# EasyEDA Pro project ProProject_Quadrotor_Mk2.epro, board PCB4
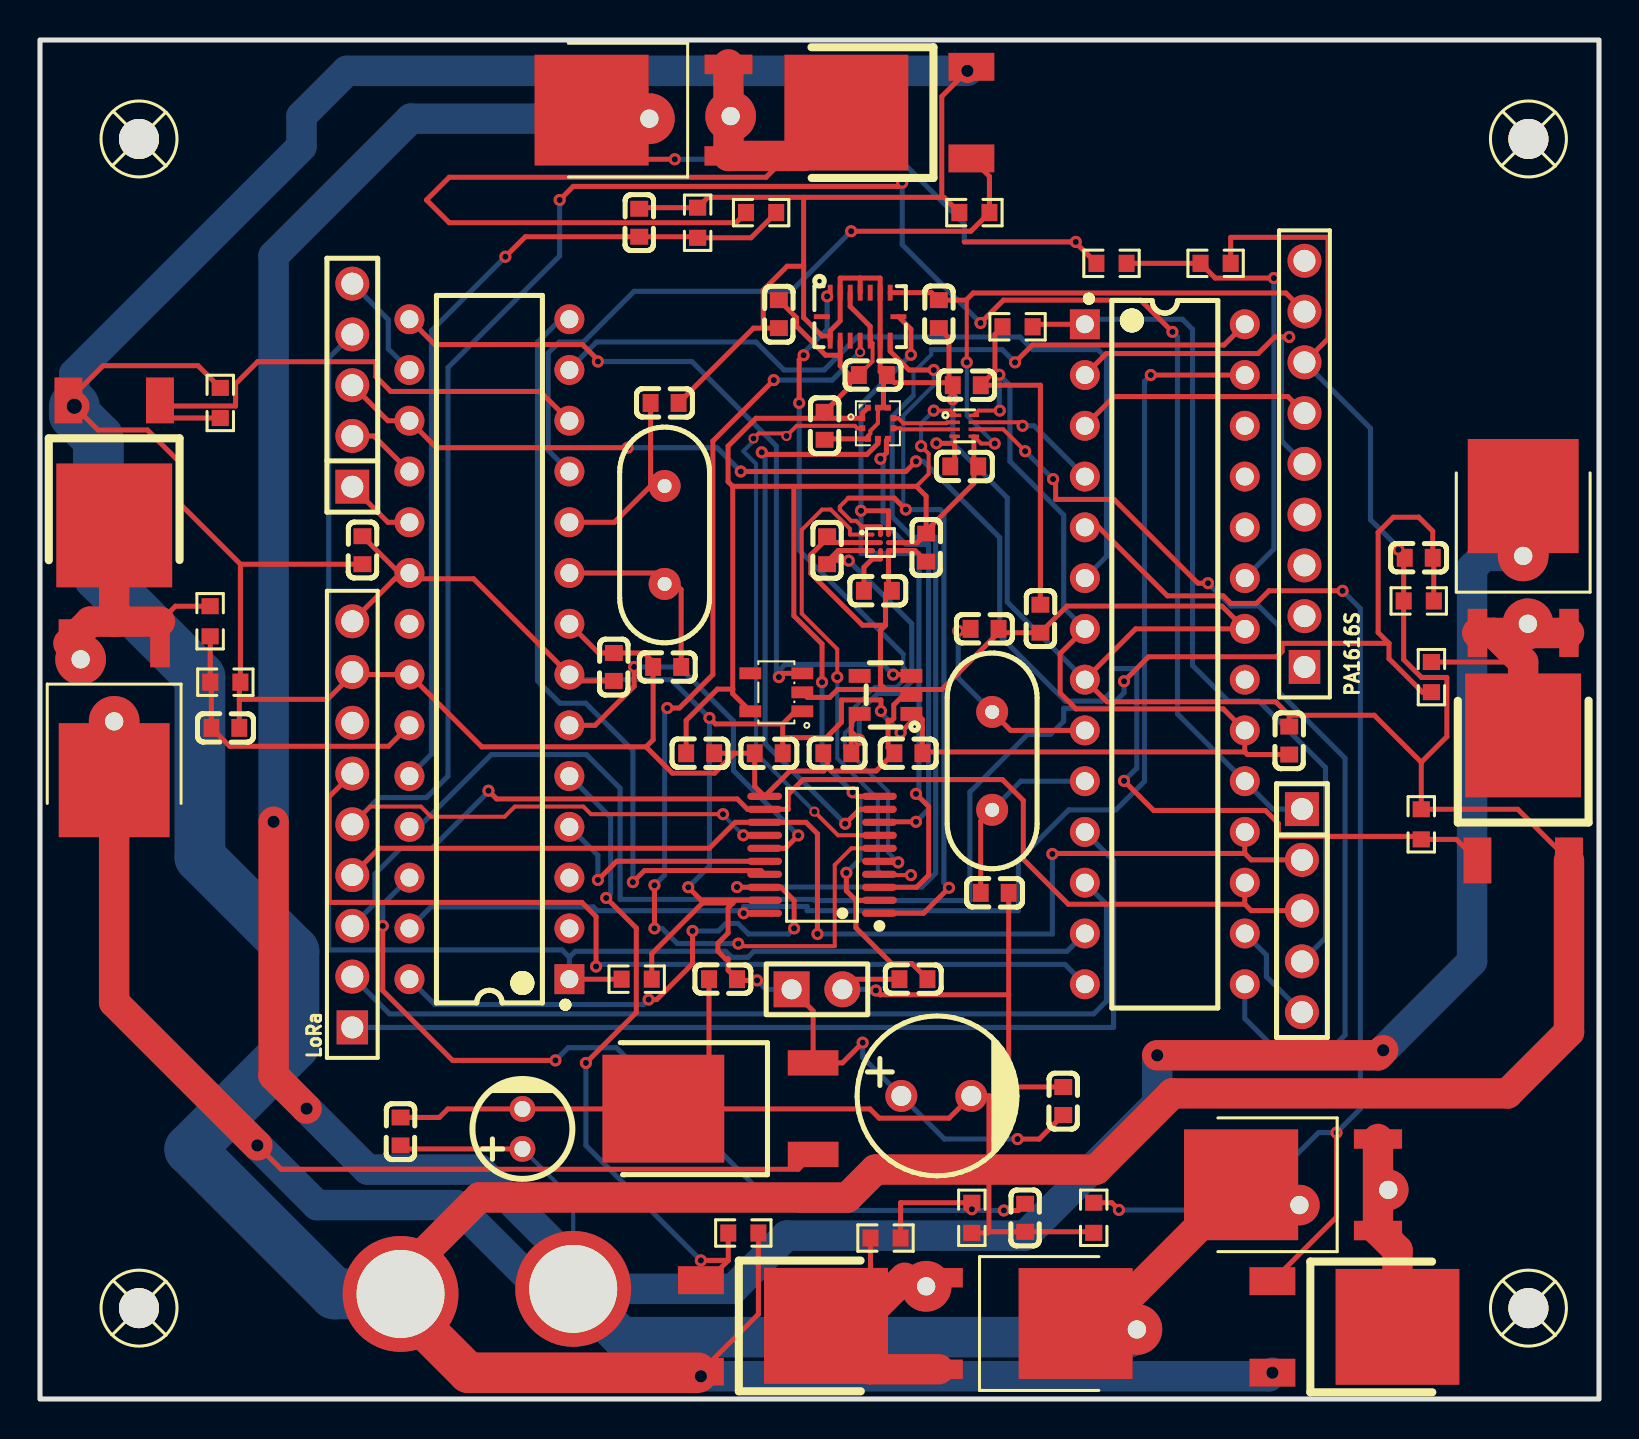
[diagram p1: board, top side]
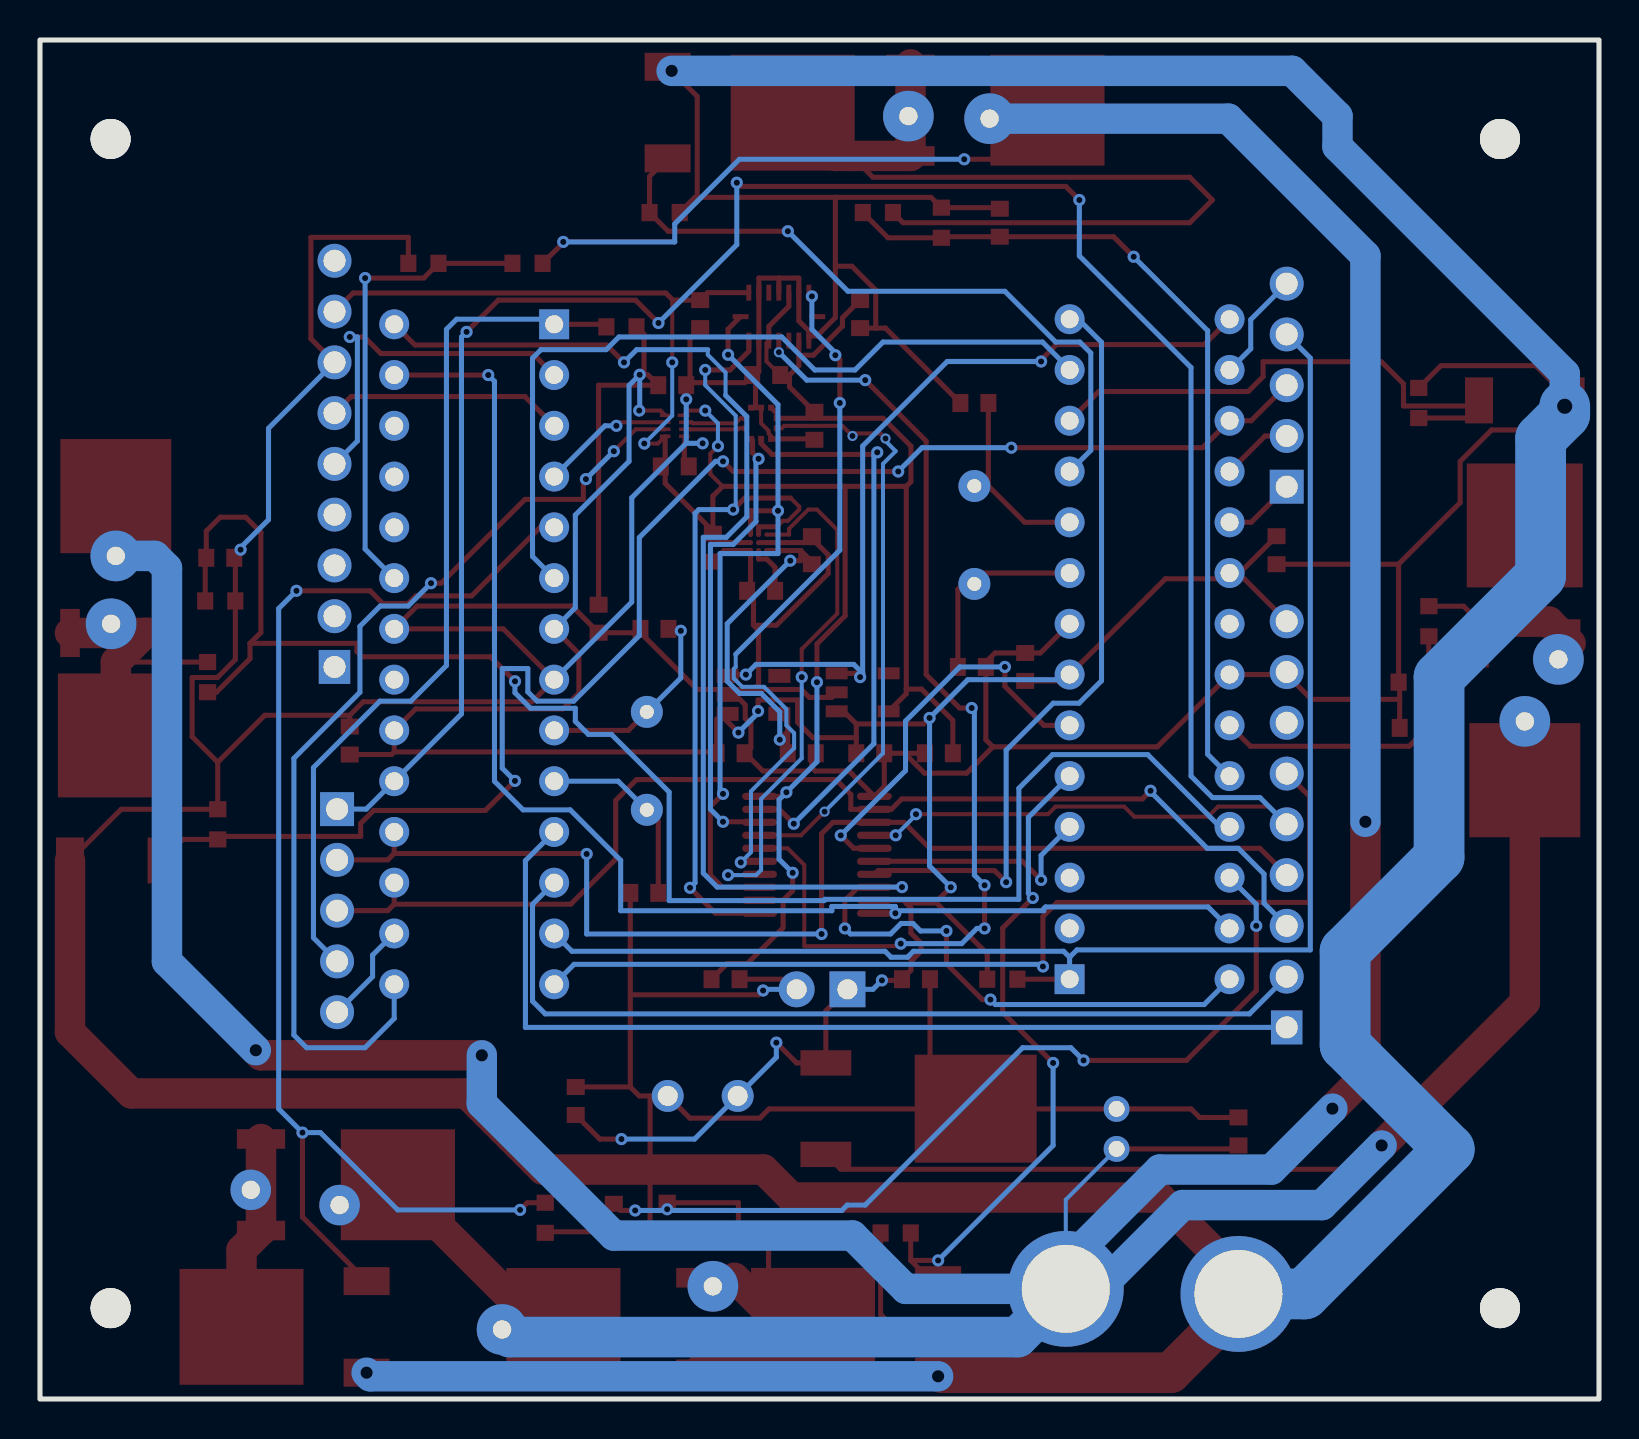
[diagram p2: board, bottom side, seen from below]

Outline 77.98 x 68 mm; copper layers: Top Layer, Bottom Layer. Coordinates in mm from the lower left corner of the outline.
Outline path: rectangle 0,68 77.98,0
Stack: Top Layer 0.035mm / Dielectric1 1.51mm FR4 er 4.5 / Bottom Layer 0.035mm

## Design rules (mm)
template: JLCPCB Capability(Two Layers Board)
spacing copperThickness1oz (default): track to track 0.102, other pairs 0.152 to 0.3
spacing copperThickness2oz: track to track 0.203, other pairs 0.152 to 0.3
track width copperThickness1oz (default): min 0.127, default 0.254, max 2.54
track width copperThickness2oz: min 0.203, default 0.254, max 2.54
differential pair differentialPair (default): width min 0.127, default 0.254, max 2.54; gap min 0.152, default 0.152
via viaSize (default): diameter min 0.5, default 0.61, max 10; hole min 0.3, default 0.305, max 6.3

## Placement (name value [footprint] x y rotation side)
1.8VR  ADP151AUJZ-1.8-R7  [TSOT-23-5_L2.9-W1.6-P0.95-LS2.8-BR]  42.29 35.23 0 top
1.8VR_C1  1uF  [C0603]  43.43 32.31 0 top
1.8VR_C2  1uF  [C0603]  39.88 32.31 0 top
3.3VR  ADP150AUJZ-3.3-R7  [SOT-23-5_L3.0-W1.7-P0.95-LS2.8-BR]  36.83 35.36 0 top
3.3VR_C1  1uF  [C0603]  36.45 32.31 180 top
3.3VR_C2  1uF  [C0603]  33.02 32.31 0 top
5V_DC  100nF  [C0603]  51.18 14.91 90 top
5VR  L7805CDT-TR  [TO-252-3_L6.5-W5.8-P4.58-BL]  34.92 14.53 90 top
12V_DC  100nF  [C0603]  18.03 13.39 90 top
BMI_DC1  100nF  [C0603]  36.96 54.28 90 top
BMI_DC2  100nF  [C0603]  44.96 54.28 270 top
BMM_CRST  2.2uF  [C0603]  41.91 40.44 0 top
BMM_DC1  100nF  [C0603]  39.37 42.47 90 top
BMM_DC2  100nF  [C0603]  44.32 42.6 270 top
BMP_DC1  100nF  [C0603]  41.66 51.23 180 top
BMP_DC2  100nF  [C0603]  39.24 48.69 270 top
C11  2.2uF  [CAP-TH_BD5.0-P2.00-D0.8-FD]  24.13 13.51 90 top
C14  100uF  [CAP-TH_BD8.0-P3.50-D0.6-FD]  44.83 15.16 0 top
C_LP1  100nF  [C0603]  9.27 33.58 180 top
C_LP2  100nF  [C0603]  29.97 58.85 270 top
C_LP3  100nF  [C0603]  68.96 42.09 0 top
C_LP4  100nF  [C0603]  49.28 9.07 90 top
D_1  MBR30100DT  [TO-252-2_L6.6-W6.1-P4.58-LS9.9-BR]  3.71 34.39 90 top
D_2  MBR30100DT  [TO-252-2_L6.6-W6.1-P4.58-LS9.9-BR]  31.01 64.48 0 top
D_3  MBR30100DT  [TO-252-2_L6.6-W6.1-P4.58-LS9.9-BR]  74.19 41.75 270 top
D_4  MBR30100DT  [TO-252-2_L6.6-W6.1-P4.58-LS9.9-BR]  48.38 3.78 180 top
D_5  MBR30100DT  [TO-252-2_L6.6-W6.1-P4.58-LS9.9-BR]  63.5 10.72 0 top
H3  -  [HDR-TH_5P-P2.54-V-M]  15.62 50.72 90 top
H4  -  [HDR-TH_5P-P2.54-V-M]  63.12 24.43 270 top
H5  -  [HDR-TH_2P-P2.54-V-M-1]  38.86 20.5 0 top
LoRa  -  [HDR-TH_9P-P2.54-V-F-1]  15.62 28.75 90 top
LS1_DC1  100nF  [C0603]  34.16 21.01 0 top
LS1_DC2  100nF  [C0603]  43.69 21.01 0 top
LS2_DC1  100nF  [C0603]  46.36 50.72 0 top
LS2_DC2  100nF  [C0603]  46.23 46.66 180 top
MCU1_DC1  100nF  [C0603]  62.48 32.94 90 top
MCU1_DC2  100nF  [C0603]  50.04 39.04 270 top
MCU1_RSTPU  10K  [R0603]  29.85 21.01 0 top
MCU2_DC1  100nF  [C0603]  28.7 36.63 90 top
MCU2_DC2  100nF  [C0603]  16.13 42.47 270 top
MCU2_RSTPU  10K  [R0603]  48.89 53.64 180 top
NOREF  -  [Pad_e160312]  2.03 37.01 0 top
NOREF#2  -  [Pad_e160313]  30.48 64.06 0 top
NOREF#3  -  [Pad_e160306]  54.86 3.48 0 top
NOREF#4  -  [Pad_e160310]  67.44 10.46 0 top
NOREF#5  -  [Pad_e160314]  34.54 64.19 0 top
NOREF#6  -  [Pad_e160315]  74.19 42.18 0 top
NOREF#7  -  [Pad_e160308]  44.32 5.64 0 top
NOREF#8  -  [Pad_e160321]  26.67 5.51 0 top
NOREF#9  -  [Pad_e160311]  3.71 33.9 0 top
NOREF#10  -  [Pad_e160316]  74.42 38.79 0 top
NOREF#11  -  [Pad_e160323]  18.03 5.26 0 top
NOREF#12  -  [Pad_e160309]  62.99 9.7 0 top
OCS1_C1  22pF  [C0603]  31.37 36.63 180 top
OCS1_C2  22pF  [C0603]  31.24 49.83 0 top
OCS2_C1  22pF  [C0603]  47.24 38.53 0 top
OCS2_C2  22pF  [C0603]  47.75 25.32 0 top
PA1616S  -  [HDR-TH_9P-P2.54-V-F-1]  63.25 46.79 90 top
R_PD1  10K  [R0603]  9.02 49.83 270 top
R_PD2  10K  [R0603]  46.74 59.36 0 top
R_PD3  10K  [R0603]  69.09 28.75 270 top
R_PD4  10K  [R0603]  35.18 8.31 180 top
R_PD5  10K  [R0603]  52.7 9.07 90 top
R_VD11  15K  [R0603]  8.51 38.91 270 top
R_VD12  10K  [R0603]  9.27 35.86 0 top
R_VD21  15K  [R0603]  36.07 59.36 0 top
R_VD22  10K  [R0603]  32.89 58.85 90 top
R_VD31  15K  [R0603]  69.6 36.12 270 top
R_VD32  10K  [R0603]  68.96 39.93 180 top
R_VD41  15K  [R0603]  42.29 8.05 0 top
R_VD42  10K  [R0603]  46.61 9.07 270 top
R_VD_BAT  20K  [R0603]  53.59 56.82 0 top
R_VD_BAT1  10K  [R0603]  58.8 56.82 0 top
SCREW1  -  [screw-hole-m2]  4.95 63.04 0 top
SCREW2  -  [screw-hole-m2]  4.95 4.55 0 top
SCREW3  -  [screw-hole-m2]  74.45 63.04 0 top
SCREW4  -  [screw-hole-m2]  74.45 4.55 0 top
T_1  IRLR2908TRPBF  [TO-252-3_L6.5-W6.1-P4.58-LS9.9-BR]  3.71 46.84 90 top
T_2  IRLR2908TRPBF  [TO-252-3_L6.5-W6.1-P4.58-LS9.9-BR]  43.46 64.36 0 top
T_3  IRLR2908TRPBF  [TO-252-3_L6.5-W6.1-P4.58-LS9.9-BR]  74.19 30.07 270 top
T_4  IRLR2908TRPBF  [TO-252-3_L6.5-W6.1-P4.58-LS9.9-BR]  36.18 3.66 180 top
T_5  IRLR2908TRPBF  [TO-252-3_L6.5-W6.1-P4.58-LS9.9-BR]  64.77 3.61 180 top
U1  MCU 1  [DIP-28_L34.6-W7.3-P2.54-LS10.2-BL]  22.48 37.52 90 top
U3  BMI088  [LGA-16_L4.5-W3.0-P0.50-BL]  41.02 54.15 270 top
U14  TXS0108EPWR  [TSSOP-20_L6.5-W4.4-P0.65-LS6.4-BL]  39.12 27.23 90 top
U15  BMM350  [WLCSP-9_L1.3-W1.3-R3-C3-P0.40-TL]  42.04 42.85 0 top
U16  MCU 2  [DIP-28_L34.6-W7.3-P2.54-LS10.2-BL]  56.26 37.26 270 top
U17  BMP390L  [LGA-10_L2.0-W2.0-P0.50-TL_BMP390L]  41.91 48.82 0 top
U18  TXS0102DQER  [X2SON-8_L1.4-W1.0-P0.35-BL]  46.23 48.69 270 top
X2  20MHz  [OSC-TH_L10.0-W4.5-P5.00]  47.63 31.93 0 top
X3  20MHz  [OSC-TH_L10.0-W4.5-P5.00]  31.24 43.23 180 top

## Footprints (pads in the part's own frame, mm; a bottom-side part is the same pattern mirrored in y, then rotated)
C0603
  rect 0.8x0.9 smd: 1(-0.7,0) 2(0.7,0)
CAP-TH_BD5.0-P2.00-D0.8-FD
  round 1.3 hole 0.8: 1(-1,0) 2(1,0)
CAP-TH_BD8.0-P3.50-D0.6-FD
  round 1.6 hole 1: 1(-1.75,0) 2(1.75,0)
DIP-28_L34.6-W7.3-P2.54-LS10.2-BL
  rect 1.5x1.5 hole 0.9: 1(-16.51,-4)
  round 1.5 hole 0.9: 2(-13.97,-4) 3(-11.43,-4) 4(-8.89,-4) 5(-6.35,-4) 6(-3.81,-4) 7(-1.27,-4) 8(1.27,-4) 9(3.81,-4) 10(6.35,-4) 11(8.89,-4) 12(11.43,-4) 13(13.97,-4) 14(16.51,-4) 15(16.51,4) 16(13.97,4) 17(11.43,4) 18(8.89,4) 19(6.35,4) 20(3.81,4) 21(1.27,4) 22(-1.27,4) 23(-3.81,4) 24(-6.35,4) 25(-8.89,4) 26(-11.43,4) 27(-13.97,4) 28(-16.51,4)
HDR-TH_2P-P2.54-V-M-1
  rect 1.8x1.8 hole 1: 1(-1.27,0)
  round 1.8 hole 1: 2(1.27,0)
HDR-TH_5P-P2.54-V-M
  rect 1.7x1.7 hole 1.1: 1(-5.08,0)
  round 1.7 hole 1.1: 2(-2.54,0) 3(0,0) 4(2.54,0) 5(5.08,0)
HDR-TH_9P-P2.54-V-F-1
  rect 1.7x1.575 hole 1.1: 1(-10.16,0)
  round 1.7 hole 1.1: 2(-7.62,0) 3(-5.08,0) 4(-2.54,0) 5(0,0) 6(2.54,0) 7(5.08,0) 8(7.62,0) 9(10.16,0)
LGA-10_L2.0-W2.0-P0.50-TL_BMP390L
  rect 0.3x0.3 smd: 1(-0.78,0.25) 2(-0.78,-0.25) 3(-0.5,-0.78) 4(0,-0.78) 5(0.5,-0.78) 6(0.78,-0.25) 7(0.78,0.25) 8(0.5,0.78) 9(0,0.78) 10(-0.5,0.78)
LGA-16_L4.5-W3.0-P0.50-BL
  rect 0.8x0.25 smd: 1(-1.2,-1.498) 2(-1.2,-0.998) 3(-1.2,-0.498) 4(-1.2,0.002) 5(-1.2,0.502) 6(-1.2,1.002) 7(-1.2,1.502) 9(1.2,1.502) 10(1.2,1.002) 11(1.2,0.502) 12(1.2,0.002) 13(1.2,-0.498) 14(1.2,-0.998) 15(1.2,-1.498)
  rect 0.25x0.8 smd: 8(0,1.915) 16(0,-1.915)
OSC-TH_L10.0-W4.5-P5.00
  round 1.6 hole 0.7: 1(0,2.45) 2(0,-2.45)
Pad_e160306
  round 2.54 hole 0.914: 29(0,0)
Pad_e160308
  round 2.54 hole 0.914: 30(0,0)
Pad_e160309
  round 2.032 hole 0.914: 31(0,0)
Pad_e160310
  round 2.032 hole 0.914: 32(0,0)
Pad_e160311
  round 2.54 hole 0.914: 33(0,0)
Pad_e160312
  round 2.54 hole 0.914: 34(0,0)
Pad_e160313
  round 2.54 hole 0.914: 35(0,0)
Pad_e160314
  round 2.54 hole 0.914: 36(0,0)
Pad_e160315
  round 2.54 hole 0.914: 37(0,0)
Pad_e160316
  round 2.54 hole 0.914: 38(0,0)
Pad_e160321
  round 5.799 hole 4.399: 39(0,0)
Pad_e160323
  round 5.799 hole 4.399: 39(0,0)
R0603
  rect 0.806x0.864 smd: 1(-0.753,0) 2(0.753,0)
screw-hole-m2
  round 2 hole 2.997: 1(0,0)
SOT-23-5_L3.0-W1.7-P0.95-LS2.8-BR
  rect 1.1x0.6 smd: 1(1.3,-0.95) 2(1.3,0) 3(1.3,0.95) 4(-1.3,0.95) 5(-1.3,-0.95)
TO-252-2_L6.6-W6.1-P4.58-LS9.9-BR
  rect 2.409x0.979 smd: 1(3.424,-2.29) 3(3.424,2.29)
  rect 5.711x5.548 smd: 2(-3.424,0)
TO-252-3_L6.5-W5.8-P4.58-BL
  rect 1.27x2.54 smd: 1(-2.288,-3.747) 3(2.288,-3.745)
  rect 5.4x6.1 smd: 2(-0.002,3.747)
TO-252-3_L6.5-W6.1-P4.58-LS9.9-BR
  rect 2.3x1.4 smd: 1(3.128,-2.29) 3(3.128,2.29)
  rect 6.2x5.8 smd: 2(-3.128,-0.004)
TSOT-23-5_L2.9-W1.6-P0.95-LS2.8-BR
  rect 1.1x0.7 smd: 1(1.294,-0.951) 2(1.294,-0.001) 3(1.294,0.951) 4(-1.294,0.951) 5(-1.294,-0.949)
TSSOP-20_L6.5-W4.4-P0.65-LS6.4-BL
  oval 0.364x1.742 smd: 1(-2.925,-2.871) 2(-2.275,-2.871) 3(-1.625,-2.871) 4(-0.975,-2.871) 5(-0.325,-2.871) 6(0.325,-2.871) 7(0.975,-2.871) 8(1.625,-2.871) 9(2.275,-2.871) 10(2.925,-2.871) 11(2.925,2.871) 12(2.275,2.871) 13(1.625,2.871) 14(0.975,2.871) 15(0.325,2.871) 16(-0.325,2.871) 17(-0.975,2.871) 18(-1.625,2.871) 19(-2.275,2.871) 20(-2.925,2.871)
WLCSP-9_L1.3-W1.3-R3-C3-P0.40-TL
  round 0.2 smd: A1(-0.4,0.4) A2(0,0.4) A3(0.4,0.4) B1(-0.4,0) B2(0,0) B3(0.4,0) C1(-0.4,-0.4) C2(0,-0.4) C3(0.4,-0.4)
X2SON-8_L1.4-W1.0-P0.35-BL
  rect 0.175x0.6 smd: 1(-0.525,-0.445)
  rect 0.175x0.53 smd: 2(-0.175,-0.48) 3(0.175,-0.48) 4(0.525,-0.48) 5(0.525,0.48) 6(0.175,0.48) 7(-0.175,0.48) 8(-0.525,0.48)

## Nets
As in the schematic, except:
12V: 5VR.1 12V_DC.1 C11.1 D_1.2 D_2.2 D_3.2 D_4.2 D_5.2 NOREF#2.35 NOREF#3.29 NOREF#6.37 NOREF#8.39 NOREF#9.33 NOREF#12.31 R_VD_BAT.1
GND: 1.8VR.2 1.8VR_C1.1 1.8VR_C2.1 3.3VR.2 3.3VR_C1.2 3.3VR_C2.2 5V_DC.2 5VR.2 12V_DC.2 BMI_DC1.1 BMI_DC2.2 BMM_CRST.2 BMM_DC1.2 BMM_DC2.2 BMP_DC1.1 BMP_DC2.2 C11.2 C14.2 C_LP1.1 C_LP2.1 C_LP3.1 C_LP4.1 H5.2 LoRa.8 LS1_DC1.1 LS1_DC2.1 LS2_DC1.1 LS2_DC2.2 MCU1_DC1.2 MCU1_DC2.2 MCU2_DC1.2 MCU2_DC2.2 NOREF#11.39 OCS1_C1.2 OCS1_C2.2 OCS2_C1.2 OCS2_C2.2 PA1616S.7 R_PD1.1 R_PD2.1 R_PD3.1 R_PD4.1 R_PD5.1 R_VD12.2 R_VD22.2 R_VD32.2 R_VD42.2 R_VD_BAT1.2 T_1.3 T_2.3 T_3.3 T_4.3 T_5.3 U1.8 U1.22 U3.2 U3.4 U3.6 U3.10 U3.15 U14.11 U15.B1 U15.B2 U15.C3 U16.8 U16.22 U17.3 U17.8 U17.9 U18.4
$1N565: D_1.1 D_1.3 NOREF.34 R_VD11.1 T_1.2
$1N1007: D_2.1 D_2.3 NOREF#5.36 R_VD21.1 T_2.2
$1N1195: D_3.1 D_3.3 NOREF#10.38 R_VD31.1 T_3.2
$1N1383: D_4.1 D_4.3 NOREF#7.30 R_VD41.1 T_4.2
$1N22123: D_5.1 D_5.3 NOREF#4.32 T_5.2

Pads without a net: 1.8VR 4; 3.3VR 4; LoRa 7; PA1616S 1 2 3 4 9; SCREW1 1; SCREW2 1; SCREW3 1; SCREW4 1; U1 2 3 21; U3 5 13 16; U16 21 24 25 26

## Via types
v1: diameter 1.219, hole 0.61, Top Layer to Bottom Layer, 8 vias
v2: diameter 1.524, hole 0.762, Top Layer to Bottom Layer, 1 via
v3: diameter 0.61, hole 0.305, Top Layer to Bottom Layer, 93 vias
v4: diameter 0.508, hole 0.3, Top Layer to Bottom Layer, 4 vias

## Routing (per net, layer and track width the routed paths; a pad name or vN(x,y) marks a point on that pad's centre or on a via; arc(x,y) is an arc through that point)
1.8V: length 18.3
  Top Layer w0.254: 39.92,42.45 39.37,41.9 BMM_DC1.1 ; 39.92,42.45 U15.C1 ; 39.92,42.45 39.92,41.94 v3(40.45,41.94) ; 1.8VR.5 40.58,33.86 40.58,33.29 ; 40.58,33.29 40.67,33.29 v3(40.98,32.99) ; 40.58,33.29 1.8VR_C2.2
  Bottom Layer w0.254: v3(40.98,32.99) 40.98,34.38 41.9,35.3 42.99,35.3 43.61,35.92 43.61,38.79 v3(40.45,41.94)
3.33V: length 127.6
  Top Layer w0.203: v3(46.36,51.87) 46.36,54.95 46.32,54.98 ; 43.83,45.66 44.45,46.28 44.45,47.29 v3(44.07,47.68) ; U3.11 41.64,52.83 41.64,51.92 BMP_DC1.2 ; 46.71,48.1 46.71,48.17 47.07,47.8 v3(47.75,47.8) ; U18.1 45.55,49.45 v3(44.7,49.45)
  Top Layer w0.254: PA1616S.8 62.32,55.34 46.68,55.34 46.32,54.98 BMI_DC2.1 44.58,55.35 U3.7 ; BMI_DC1.2 37.84,54.1 37.84,53.68 39.29,52.22 40.02,52.22 ; 40.02,52.22 40.02,51.7 40.49,51.23 ; 40.02,52.22 U3.14 ; 39.24,49.07 35.81,49.07 34.42,47.68 34.42,45.89 34.65,45.66 ; 39.24,49.07 U17.1 41.13,49.32 U17.10 ; 39.24,49.07 BMP_DC2.1 40.49,50.64 40.49,51.23 ; 34.65,45.66 37.71,45.66 ; 34.65,45.66 34.65,35.52 ; 34.65,35.52 34.65,35.29 3.3VR.5 ; 34.65,35.52 33.88,35.52 32.32,33.95 3.3VR_C2.1 ; LS1_DC2.2 43.61,21.79 42.6,21.79 40.81,23.58 40.81,24.95 ; 40.49,51.23 BMP_DC1.2 ; 37.71,45.66 43.83,45.66 44.32,45.17 44.32,43.43 ; 37.71,45.66 37.71,39.19 39.12,37.78 v3(39.12,35.86) ; 46.71,46.66 46.93,46.66 ; 46.71,46.66 46.71,45.81 44.32,43.43 ; 46.71,46.66 46.71,48.1 ; v3(40.33,26.33) 40.33,25.43 40.81,24.95 ; U3.11 41.52,53.66 40.52,54.66 U3.3 ; 44.32,43.43 BMM_DC2.1 43.88,42.85 U15.B3 ; 40.81,24.95 41.99,24.95 ; 41.99,30.15 40.85,30.15 v3(40.64,30.36)
  Bottom Layer w0.203: v3(46.36,51.87) 46.36,49.2 v3(47.75,47.8) ; v3(44.07,47.68) 44.07,48.82 v3(44.7,49.45)
  Bottom Layer w0.254: v3(40.33,26.33) 41.01,27.01 41.01,29.99 v3(40.64,30.36) 39.12,31.89 v3(39.12,35.86)
5V: length 161.5
  Top Layer w0.203: v3(48.01,49.45) 46.95,49.45 46.71,49.22
  Top Layer w0.254: 18.48,41.04 21.69,41.04 U1.7 26.8,35.93 MCU2_DC1.1 ; 18.48,41.04 17.75,41.04 LoRa.9 ; 18.48,41.04 U1.20 17.97,41.33 MCU2_DC2.1 ; 34.66,24.82 33.14,24.82 30.6,22.28 MCU1_RSTPU.2 ; 34.66,24.82 34.66,24.95 ; 34.66,24.82 34.42,24.57 34.42,23.31 33.91,22.8 33.91,22.4 34.29,22.02 34.42,22.02 34.42,21.45 LS1_DC1.2 34.92,20.95 v3(35.87,20.95) ; 60.26,32.38 44.13,32.38 ; 60.26,32.38 60.39,32.24 MCU1_DC1.1 ; 60.26,32.38 U16.20 59.19,34.53 51.82,34.53 51.02,35.32 51.02,37.29 U16.7 ; 44.13,32.38 1.8VR_C1.2 ; 44.13,32.38 44.13,34 43.86,34.28 ; 1.8VR.1 43.86,34.28 ; 43.86,34.28 43.86,34.16 v3(43.04,33.34) ; 3.3VR.1 37.78,34.41 37.15,33.78 ; 37.15,33.09 3.3VR_C1.1 ; 37.15,33.09 37.15,33.78 ; 37.15,33.09 39.32,33.09 40.09,33.86 40.09,34.98 42.06,34.98 v3(42.06,34.42) ; 5V_DC.1 49.98,13 v3(48.89,13) ; H5.1 38.67,19.42 5VR.3 40.13,16.82 v3(41.15,17.83) ; 34.66,24.95 33.08,24.95 v3(32.42,25.61) ; 34.66,24.95 36.25,24.95 ; 37.15,33.78 33.78,33.78 v3(33.48,34.08) ; 47.77,51.25 v3(47.98,51.25) ; 47.77,51.25 47.77,53.27 MCU2_RSTPU.2 ; 47.77,51.25 47.58,51.25 LS2_DC1.2 50.04,50.72 MCU1_DC2.1
  Bottom Layer w0.254: v3(48.89,13) 45.24,13 C14.1 41.15,17.1 v3(41.15,17.83) ; v3(35.87,20.95) 36.31,20.5 H5.1 ; v3(32.42,25.61) 33.48,26.67 v3(33.48,34.08) 31.57,35.99 26.73,35.99 U1.7 ; v3(48.01,49.45) 47.98,49.48 v3(47.98,51.25) 48.51,50.71 48.51,46.91 51.2,44.23 51.2,39.59 U16.7 ; v3(42.06,34.42) 42.06,34.33 v3(43.04,33.34)
12V: length 316
  Top Layer w0.254: C11.1 18.21,12.51 12V_DC.1 ; 38.67,12.24 37.93,11.5 12.06,11.5 v1(10.87,12.69) ; 46.23,57.89 51.77,57.89 R_VD_BAT.1 ; D_2.2 30.05,62.03 v3(31.75,62.03) ; 51.8,4.25 D_4.2
  Top Layer w1.524: v1(55.88,17.2) 66.93,17.2 v1(67.18,17.45) ; 51.8,4.25 53.61,4.25 D_5.2 ; v1(10.87,12.69) 3.71,19.85 D_1.2 ; v1(11.68,28.88) 11.68,16.18 v1(13.34,14.53)
  Bottom Layer w0.203: C11.1 26.67,9.97 26.67,6.78 ; NOREF#8.39 26.67,4.88
  Bottom Layer w0.254: v3(51.81,57.89) 46.23,57.89 46.23,58.79 43,62.03 v3(31.75,62.03)
  Bottom Layer w1.524: NOREF#8.39 34.67,5.51 37.34,8.18 49.28,8.18 55.88,14.78 v1(55.88,17.2) ; NOREF#8.39 26.67,6.78 21.97,11.48 16.38,11.48 v1(13.34,14.53) ; NOREF#8.39 25.02,5.51 20.83,9.7 13.86,9.7 v1(10.87,12.69) ; NOREF#2.35 18.54,64.06 11.68,57.2 v1(11.68,28.88) ; v1(67.18,17.45) 71.63,21.89 71.63,41.58 72.23,42.18 NOREF#6.37
  Bottom Layer w2.032: NOREF#8.39 29.08,3.1 54.48,3.1 NOREF#3.29
GND: length 609
  Top Layer w0.203: U17.3 41.41,48.18 41.53,48.31 ; 41.53,48.31 41.53,48.44 41.91,48.82 U17.9 ; 45.75,47.82 U18.4
  Top Layer w0.254: 47.46,8.37 47.41,8.31 R_VD42.2 ; 47.46,8.37 C_LP4.1 52.65,8.37 R_PD5.1 ; 47.46,8.37 47.46,15.16 ; OCS2_C1.2 47.94,38.34 ; 47.94,38.34 45.1,35.5 43.58,35.5 ; 47.94,38.34 MCU1_DC2.2 51.37,39.67 59.12,39.67 U16.22 54.8,38.53 U16.8 53.37,34.88 61.81,34.88 62.48,34.21 ; 39.52,53.19 U3.15 ; 39.52,53.19 39.52,53.44 40.02,53.94 U3.2 40.02,56.08 41.02,56.08 ; 39.52,53.19 39.11,53.19 38.2,54.1 38.2,56.68 ; 12V_DC.2 19.97,14.09 20.4,14.51 C11.2 31.18,14.51 ; 45.11,60.12 45.11,65.17 T_2.3 ; 45.11,60.12 38.2,60.12 ; 45.11,60.12 45.22,60.12 R_PD2.1 ; C_LP2.1 30.03,59.61 R_VD22.2 33.41,60.12 38.2,60.12 ; U17.3 39.29,48.04 BMP_DC2.2 ; 30.31,32.63 30.67,32.99 OCS1_C1.2 30.67,36.87 30.21,37.33 MCU2_DC1.2 27.94,37.33 U1.8 ; 30.31,32.63 31.63,31.31 33.74,31.31 34.73,32.31 ; 30.31,32.63 22.09,32.63 U1.22 15.62,36.25 ; 39.37,42.85 39.17,42.85 38.55,42.23 38.55,41.3 41.14,38.72 42.29,38.72 ; 39.37,42.85 BMM_DC1.2 ; 39.37,42.85 U15.B1 U15.B2 ; 42.19,51.23 42.36,51.23 42.74,50.85 45.47,50.85 45.47,53.07 BMI_DC2.2 ; 42.19,51.23 42.02,51.4 U3.10 U3.6 42.02,56.08 41.02,56.08 ; 42.19,51.23 42.19,49.6 ; 34.73,32.31 3.3VR_C1.2 35.75,30.65 36.25,30.15 37.51,31.42 39.2,31.42 39.39,31.6 ; 34.73,32.31 33.72,32.31 ; 48.45,25.32 48.45,20.22 ; 48.45,20.22 42.02,20.22 v3(41.81,20.44) ; 48.45,20.22 48.45,15.61 ; v3(44.84,47.82) 45.75,47.82 45.75,46.88 LS2_DC2.2 ; PA1616S.7 64.43,53.05 64.43,58.12 59.55,58.12 R_VD_BAT1.2 ; 62.48,34.21 MCU1_DC1.2 ; 62.48,34.21 66.74,34.21 69.09,31.86 ; 41.02,56.08 U3.4 ; 39.39,31.6 39.57,31.42 41.82,31.42 42.7,32.31 ; 39.39,31.6 39.39,32.1 1.8VR_C2.1 ; LS1_DC1.1 33.46,16.81 5VR.2 31.18,14.51 ; LS2_DC1.1 v3(45.66,50.02) ; 38.2,60.12 38.2,56.68 ; BMM_DC2.2 43.77,42.45 U15.C3 42.44,40.44 ; 42.29,35.5 42.04,35.76 42.04,38.46 42.29,38.72 ; 42.29,35.5 39.89,35.5 39.5,35.1 38.38,35.1 3.3VR.2 ; 42.29,35.5 43.58,35.5 ; OCS1_C2.2 35.69,53.58 36.18,53.58 ; 69.09,31.86 R_PD3.1 73.91,29.51 76.48,26.94 ; 69.09,31.86 70.37,33.14 70.37,36.1 69.1,36.1 68.21,36.99 R_VD32.2 68.21,42.03 C_LP3.1 ; 15.62,36.25 14.38,35.01 9.97,35.01 ; 15.62,36.25 LoRa.8 ; 9.97,35.01 C_LP1.1 ; 9.97,35.01 9.97,35.81 R_VD12.2 10.02,41.77 ; 42.29,38.72 42.29,40.29 42.44,40.44 ; 36.18,53.58 36.18,55.48 37.37,56.68 38.2,56.68 ; 36.18,53.58 BMI_DC1.1 ; 31.18,14.51 41.51,14.51 41.97,14.05 45.47,14.05 C14.2 47.46,15.16 ; 42.19,49.6 U17.8 ; 42.19,49.6 U17.9 ; 48.45,15.61 51.18,15.61 5V_DC.2 ; 48.45,15.61 48,15.16 47.46,15.16 ; 42.7,32.31 42.42,32.59 42.42,33.96 42.61,33.96 42.7,34.05 42.7,34.73 43.2,35.23 1.8VR.2 43.58,35.5 ; 42.7,32.31 42.73,32.31 ; 10.02,41.77 6.95,44.85 6.95,46.91 5.37,48.48 2.9,48.48 T_1.3 3.16,51.7 7.9,51.7 R_PD1.1 ; 10.02,41.77 MCU2_DC2.2 ; v1(33.06,1.14) T_4.3 35.93,4.24 R_PD4.1 ; H5.2 40.64,21.01 LS1_DC2.1 ; 42.44,40.44 BMM_CRST.2
  Top Layer w1.524: 76.48,26.94 76.48,18.36 73.41,15.29 56.64,15.29 52.83,11.48 41.78,11.48 40.39,10.08 21.97,10.08 18.03,6.15 NOREF#11.39
  Top Layer w2.032: 32.88,1.32 21.42,1.32 18.37,4.37
  Bottom Layer w0.254: v3(41.81,20.44) 41.75,20.5 H5.2 ; 45.66,47.82 48.38,45.09 48.38,39.87 U16.8 ; 45.66,47.82 v3(44.84,47.82) ; 45.66,47.82 v3(45.66,50.02) ; PA1616S.7 66.55,48.56 66.55,43.99 67.95,42.6
  Bottom Layer w1.524: v1(33.06,1.14) 61.46,1.14 v1(61.64,1.32) ; v2(1.72,49.67) 1.72,51.3 13.08,62.66 13.08,64.19 15.35,66.45 v1(46.39,66.45)
  Bottom Layer w2.54: NOREF#11.39 14.73,5.26 7.49,12.5 12.7,17.7 12.7,22.4 8,27.1 8,36.12 2.92,41.2 2.92,48.06 1.72,49.26 v2(1.72,49.67)
  vias: v3(67.95,42.49)
BEMF_1: length 15.3
  Top Layer w0.254: R_VD11.2 8.52,38.15 R_VD12.1 8.57,35.81 C_LP1.2 9.49,32.66 17.43,32.66 U1.23
BEMF_2: length 42.5
  Top Layer w0.254: v3(23.28,57.15) 24.28,58.15 C_LP2.2 32.84,58.15 R_VD22.1 35.56,58.1 R_VD21.2
  Bottom Layer w0.254: U1.24 19.58,32.26 19.58,53.45 v3(23.28,57.15)
BEMF_3: length 82.5
  Top Layer w0.254: 67.47,37.81 62.13,37.81 62.13,37.4 61.86,37.13 55.45,37.13 v3(54.22,35.91) ; 67.47,37.81 67.47,37.04 69.15,35.37 R_VD31.2 ; 67.47,37.81 66.93,38.35 66.93,43.36 67.69,44.12 68.96,44.12 69.66,43.42 C_LP3.2 69.71,42.03 R_VD32.1
  Bottom Layer w0.254: v3(54.22,35.91) 54.22,35.34 53.44,34.56 51.2,34.56 51.2,33.91 50.55,33.25 49.4,33.25 46.51,30.37 46.51,24.94 38.76,24.94 38.73,24.97 38.73,25 29.02,25 29.02,30.55 27.33,32.24 22.57,32.24 18.95,28.63 U1.25
BEMF_4: length 48.9
  Top Layer w0.254: v3(17.15,23.67) 17.15,20.43 20.64,16.94 v3(25.78,16.94) ; 49.28,9.77 48.94,9.43 v3(48.21,9.43) ; R_VD41.2 43.04,9.82 R_VD42.1
  Bottom Layer w0.254: U1.26 17.15,24.75 v3(17.15,23.67) ; v3(25.78,16.94) 26.42,17.58 28.83,17.58 36.7,9.7 37.6,9.7 37.87,9.43 v3(48.21,9.43)
  vias: v3(46.61,9.49)
BMI_A_INT_3.33V: length 34.1
  Top Layer w0.254: v3(37.97,49.83) 37.97,52 v3(38.2,52.22)
  Bottom Layer w0.203: 43.18,37.26 43.18,36.63 43.28,36.53 43.28,36.05 42.85,35.63 41.76,35.63 40.65,34.52 40.65,33.71 40.26,33.32 40.26,32.56 42.42,30.4 42.42,27.36 v3(42.93,26.85)
  Bottom Layer w0.254: 38.1,52.25 39.37,53.52 v3(39.37,55.17) ; 43.18,37.26 37.97,42.47 v3(37.97,49.83)
BMI_A_INT_5V: length 12
  Top Layer w0.254: U14.16 28.84,26.9 v3(27.91,25.97)
  Bottom Layer w0.254: v3(27.91,25.97) 27.91,27.2 U1.4
BMI_G_INT_3.33V: length 51.7
  Top Layer w0.203: U14.6 40.58,27.55 39.75,26.72 39.75,22.66 35.05,22.66 v3(34.92,22.78) ; v4(41.02,52.37) 41.02,52.38 U3.12
  Top Layer w0.254: v3(36.7,50.98) 33.66,47.93 33.66,36.25 31.98,34.57 v3(31.38,34.57) ; v3(30.73,25.7) v3(30.73,23.55)
  Bottom Layer w0.254: v3(34.92,22.78) 31.88,22.78 31.11,23.55 v3(30.73,23.55) ; 31.24,34.59 31.24,26.21 v3(30.73,25.7) ; v4(41.02,52.37) 39.62,50.98 v3(36.7,50.98)
BMI_G_INT_5V: length 20.1
  Top Layer w0.254: v3(37.93,28.2) 37.28,27.55 U14.15 ; U1.6 27.76,33.71 29.72,35.66 v3(29.72,36.63)
  Bottom Layer w0.254: v3(29.72,36.63) 31.98,36.63 34.69,33.92 34.69,31.44 v3(37.93,28.2)
BMM_INT_3.33V: length 26.6
  Top Layer w0.203: U14.4 42.03,26.21 v3(43.56,26.21) ; v3(39.88,36.12) 39.88,37.52 38.1,39.29 38.1,43.48 39.12,44.5 39.55,44.5 40.51,43.54 40.51,43.25 U15.A1
  Bottom Layer w0.203: v3(39.88,36.12) 39.88,32.05 41.91,30.02 41.91,26.47 42.16,26.21 v3(43.56,26.21)
BMM_INT_5V: length 38.7
  Top Layer w0.254: v3(29.65,25.86) 30.24,26.44 36.06,26.44 U14.17
  Bottom Layer w0.254: v3(29.65,25.86) 29.65,32.46 27.3,34.81 26.01,34.81 24.88,35.94 24.88,52.87 26.04,54.03 U1.14
BMP_CS_3.33V: length 2.8
  Top Layer w0.203: 45.47,48.53 45.46,48.51 43.07,48.51 43.02,48.57 U17.6
BMP_CS_5V: length 49.3
  Top Layer w0.203: 46.71,48.52 48.18,48.52 v3(49.28,47.42)
  Top Layer w0.254: v3(58.42,40.82) 57.91,40.82 53.72,45.01 50.8,45.01 50.8,45.9 v3(50.67,46.02)
  Bottom Layer w0.254: v3(58.42,40.82) 59.56,39.67 60.96,39.67 61.98,38.66 61.98,35.36 65.28,32.05 65.28,18.21 64.64,17.58 61.72,17.58 60.26,19.04 U16.15 ; v3(50.67,46.02) v3(49.28,47.42)
BMP_INT_3.33V: length 3.2
  Top Layer w0.203: U17.7 42.94,49.07 43.19,48.82 45.33,48.82 45.38,48.87 U18.2
BMP_INT_5V: length 6.7
  Top Layer w0.203: v3(49.15,48.69) 48.97,48.87 46.71,48.87
  Bottom Layer w0.254: v3(49.15,48.69) 49.72,48.69 U16.4
LORA_CS: length 45.1
  Bottom Layer w0.254: LoRa.2 17.48,19.27 52.71,19.27 53.34,19.91 53.34,24.75 U16.12
LORA_GO: length 48
  Top Layer w0.254: LoRa.6 14.46,30.14 14.46,24.85 27.1,24.85 27.81,24.14 v3(27.81,21.64)
  Bottom Layer w0.254: U16.14 51.27,21.75 27.92,21.75 v3(27.81,21.64)
LORA_RST: length 48.5
  Bottom Layer w0.254: LoRa.1 53.7,18.59 53.7,26.93 U16.11
MCU2RX_GPSTX: length 18.2
  Top Layer w0.254: v3(62.48,53.14) 61.76,53.14 60.93,52.31 53.34,52.31 U16.2
  Bottom Layer w0.254: v3(62.48,53.14) 62.1,53.14 62.1,47.93 PA1616S.5
MCU2TX_GPSRX: length 11.9
  Top Layer w0.254: U16.3 53.73,50.16 62.42,50.16 PA1616S.6
MISO_3.33V: length 23.1
  Top Layer w0.254: v3(42.04,47.04) 42.34,47.34 42.34,47.97 U17.5 ; v3(43.82,28.88) 42.01,28.88 U14.8
  Bottom Layer w0.254: v3(42.04,47.04) 42.17,46.91 42.17,43.9 43.31,42.76 44.45,42.76 44.45,29.51 v3(43.82,28.88)
MISO_MCU1: length 3.6
  Top Layer w0.254: H3.2 16.7,48.18 U1.18
MISO_MCU2: length 59.1
  Top Layer w0.254: v3(38.89,23.27) 38.89,28.28 38.32,28.85 U14.13 34.77,28.85 33.47,27.56 16.96,27.56 LoRa.4 ; 60.26,27.3 60.58,26.97 H4.2 ; 60.26,27.3 50.66,27.3 v3(50.64,27.27) ; 60.26,27.3 U16.18
  Bottom Layer w0.254: v3(50.64,27.27) 50.64,23.27 v3(38.89,23.27)
MOSI_3.33V: length 28.6
  Top Layer w0.254: U17.4 41.91,47.81 41.36,47.26 36.21,47.26 v3(36.1,47.37) ; U14.9 41,29.5 v3(40.28,28.78)
  Bottom Layer w0.254: v3(36.1,47.37) 36.27,47.2 36.27,32.79 v3(40.28,28.78)
MOSI_MCU2: length 58.1
  Top Layer w0.254: 60.26,24.76 U16.17 ; 60.26,24.76 60.58,24.43 H4.3 ; 60.26,24.76 51.43,24.76 49.18,27 49.18,29.95 48.14,30.99 38.17,30.99 37.42,30.25 37.42,29.5 U14.12 35.39,29.5 34.88,30.02 22.84,30.02 v3(22.43,30.43)
  Bottom Layer w0.254: v3(22.43,30.43) 22.43,30.39 19.59,27.55 18.04,27.55 16.76,26.27 16.76,24.81 LoRa.3
OE_5V: length 41.1
  Top Layer w0.254: v3(27.91,51.91) 27.91,51.99 27.14,52.76 19.75,52.76 U1.15 ; 1.8VR.3 43.52,36.25 v3(42.67,36.25) ; v3(36.96,36.12) 37.14,36.31 3.3VR.3
  Bottom Layer w0.254: 36.83,36.31 36.96,36.18 v3(36.96,36.12) ; 36.83,36.31 36.83,47.68 32.6,51.91 v3(27.91,51.91) ; 36.83,36.31 37.27,36.75 42.16,36.75 v3(42.67,36.25)
PWM_FAN: length 65.4
  Top Layer w0.254: v3(65.15,40.44) 61.47,40.44 60.83,39.8 59.56,39.8 59.18,40.18 56.39,40.18 52.96,43.61 U16.5 ; v3(53.97,9.46) 53.61,9.82 R_PD5.2 ; T_5.1 64.85,9.1 v3(64.85,13.33)
  Bottom Layer w0.254: v3(65.15,40.44) 66.04,39.55 66.04,14.52 v3(64.85,13.33) 63.95,13.33 60.08,9.46 v3(53.97,9.46)
PWM_T1: length 27.3
  Top Layer w0.254: U1.12 25.01,50.41 17.55,50.41 16.8,51.15 16.8,51.9 10.89,51.9 9.78,50.79 9.78,49.68 6,49.68 ; 6,49.68 6.6,49.08 R_PD1.2 ; 6,49.68 T_1.1
PWM_T2: length 34.4
  Top Layer w0.254: v3(40.57,58.43) 46.56,58.43 R_PD2.2 47.49,61.17 T_2.1
  Bottom Layer w0.254: v3(40.57,58.43) 37.57,55.42 29.72,55.42 27.18,52.88 25.97,52.88 25.42,52.33 25.42,47.46 U1.11
PWM_T3/MOSI: length 76
  Top Layer w0.254: v3(54.22,30.93) 55.7,29.45 61.29,29.45 61.94,28.8 61.94,28.15 68.94,28.15 R_PD3.2 70.84,28 T_3.1 ; v3(35.05,46.41) 43.31,46.41 v3(43.82,46.91) ; v3(29.4,47.6) 19.83,47.6 U1.17 17.4,48.95 H3.3
  Bottom Layer w0.254: v3(54.22,30.93) 54.86,31.56 54.86,36.55 53.58,36.55 53.58,35.38 53.11,34.92 51.28,34.92 48,38.2 48,43.1 44.19,46.91 v3(43.82,46.91) ; v3(29.4,47.6) 33.86,47.6 v3(35.05,46.41)
PWM_T4: length 33.7
  Top Layer w0.254: 34.43,6.93 33.44,5.95 T_4.1 ; 34.43,6.93 v3(33.06,6.93) ; 34.43,6.93 R_PD4.2 ; v3(27.3,16.81) 29.83,19.34 29.83,23.56 v3(28.32,25.07)
  Bottom Layer w0.254: v3(33.06,6.93) 27.3,12.69 v3(27.3,16.81) ; U1.5 28.54,29.1 28.54,25.29 v3(28.32,25.07)
RST_MCU1: length 73.7
  Top Layer w0.254: U1.1 MCU1_RSTPU.1
  Bottom Layer w0.254: U16.13 51.37,22.4 35.71,22.4 35.41,22.1 34.59,22.1 34.29,22.4 26.78,22.4 26.48,22.1 ; 26.48,22.1 U1.1 ; 26.48,22.1 26.11,22.47 14.44,22.47 14.44,52.08 H3.4
RST_MCU2: length 44.1
  Top Layer w0.254: U16.1 49.78,53.77 MCU2_RSTPU.1
  Bottom Layer w0.254: H4.4 64.3,23.08 64.3,31.59 60.97,34.92 59.43,34.92 57.65,36.7 57.65,53.52 57.14,54.03 52.52,54.03 U16.1
SCK_3.33V: length 30
  Top Layer w0.203: U17.2 40.88,48.57 40.76,48.69 37.85,48.69 v4(37.34,48.18) 37.21,48.31 35.94,48.31 v4(35.69,48.06) ; v4(38.73,29.39) 39.92,28.2 U14.7
  Bottom Layer w0.203: v4(35.69,48.06) 35.69,47.93 35.18,47.42 35.81,46.79 35.81,32.31 v4(38.73,29.39)
SCK_MCU1: length 3.6
  Top Layer w0.254: U1.19 17.4,43.87 H3.1
SCK_MCU2: length 123.2
  Top Layer w0.203: LoRa.5 16.51,29.64 19.05,29.64 19.56,29.13 23.24,29.13 23.75,29.64 27.18,29.64 27.56,29.26 v3(34.16,29.26) ; U14.14 v3(35.18,28.2)
  Top Layer w0.254: v3(47.04,53.84) 48.19,54.98 55.05,54.98 v3(56.64,53.39) ; v3(43.13,60.85) 42.94,60.67 26.67,60.67 v3(25.99,59.99)
  Bottom Layer w0.203: v3(34.16,29.26) 34.16,29.22 v3(35.18,28.2)
  Bottom Layer w0.254: v3(25.99,59.99) 25.99,57.19 20.41,51.61 20.41,31.17 19.33,30.09 16.96,30.09 LoRa.5 ; v3(47.04,53.84) 43.13,57.75 v3(43.13,60.85) ; H4.1 61.66,29.51 U16.19 56.9,34.28 56.9,53.14 v3(56.64,53.39)
SCL_3.33V: length 37.7
  Top Layer w0.254: U15.A3 42.44,44.44 v3(41.07,44.44) ; U3.8 43.56,53.53 v3(43.56,52.25) ; v3(43.82,30.28) 44.45,29.64 44.45,26.21 43.84,25.6 U14.3
  Bottom Layer w0.254: v3(43.56,52.25) 41.07,49.75 v3(41.07,44.44) 41.07,42.3 43.96,42.3 43.96,30.42 v3(43.82,30.28)
SCL_5V: length 82.8
  Top Layer w0.254: v3(32.64,23.42) 32.64,21.78 30.85,19.99 v3(30.44,19.99) ; v3(37.72,23.55) 37.72,24.94 37.06,25.6 U14.18 34.87,25.6 v3(34.86,25.61) ; U16.28 59.22,52.73 49.64,52.73 v3(48.77,51.87)
  Bottom Layer w0.203: 43.69,50.22 43.69,51.36 44.58,52.25 44.58,52.5
  Bottom Layer w0.254: v3(32.64,23.42) 33.94,23.42 34.31,23.79 34.91,23.79 35.44,23.27 37.44,23.27 v3(37.72,23.55) ; v3(34.86,25.61) 44.1,25.61 44.8,26.31 44.8,43.11 43.65,43.11 42.63,44.14 42.63,49.15 43.69,50.22 ; v3(30.44,19.99) 30.19,19.74 19.75,19.74 U1.28 ; 44.58,52.5 48.13,52.5 v3(48.77,51.87)
SDA_3.33V: length 42.2
  Top Layer w0.203: 41.12,43.64 40.82,43.94 40.57,43.94 40.01,44.5 40.01,44.65 40.43,45.08
  Top Layer w0.254: U15.A2 42.04,43.64 41.12,43.64 ; U3.9 42.52,52.43 43.46,51.49 v3(44.7,51.49) ; v3(45.47,25.58) 44.19,24.3 U14.1 ; v3(43.31,44.5) 42.73,45.08 40.43,45.08
  Bottom Layer w0.203: v3(43.31,44.5) 43.18,44.63 43.18,49.2 44.7,50.72 v3(44.7,51.49)
  Bottom Layer w0.254: v3(43.31,44.5) 45.02,44.5 45.21,44.31 45.21,25.83 v3(45.47,25.58)
SDA_5V: length 68.3
  Top Layer w0.254: v3(35.19,24.3) U14.20 ; v3(55.56,51.23) U16.27
  Bottom Layer w0.254: 35.19,24.43 35.19,24.64 38.37,24.64 38.37,24.43 48.93,24.43 48.93,26.95 51.46,29.48 53.81,29.48 55.25,30.91 55.25,50.92 v3(55.56,51.23) ; 35.19,24.43 v3(35.19,24.3) ; 35.19,24.43 27.77,24.43 27.77,24.53 27.68,24.62 19.55,24.62 U1.27
SS_MCU1: length 5.5
  Bottom Layer w0.254: U1.16 17.42,52.54 17.42,54 H3.5
SS_MCU2: length 5.1
  Bottom Layer w0.254: U16.16 61.34,22.21 61.34,21.13 H4.5
START: length 40.6
  Bottom Layer w0.254: U1.13 26.48,51.53 27.84,52.88 35.81,52.88 37.21,51.49 39.23,51.49 40.88,53.14 49.02,53.14 49.66,52.5 52.92,52.5 53.34,52.08 53.34,42.15 U16.6
VD_BATTERY: length 23.3
  Top Layer w0.254: R_VD_BAT.2 R_VD_BAT1.1 58.78,56.08 v3(61.72,56.08)
  Bottom Layer w0.254: v3(61.72,56.08) 61.72,42.53 U16.23
$1N565: length 13.8
  Top Layer w0.254: D_1.1 6,38.89 6.77,39.67 R_VD11.1
  Top Layer w1.524: D_1.3 2.51,38.89 3.71,38.89 ; 3.71,38.89 6,38.89 ; 3.71,38.89 T_1.2
$1N1007: length 47
  Top Layer w0.254: 37.38,62.19 36.32,61.13 20.47,61.13 19.33,59.99 20.47,58.85 34.81,58.85 R_VD21.1
  Top Layer w1.524: D_2.3 D_2.1 38.17,62.19 T_2.2
$1N1195: length 15.7
  Top Layer w0.254: 74.18,36.87 R_VD31.1
  Top Layer w1.524: T_3.2 74.18,36.87 72.73,38.33 D_3.1 76.48,38.33
$1N1383: length 16.9
  Top Layer w0.254: R_VD41.1 41.54,6.07 D_4.1
  Top Layer w1.524: 43.25,6.07 40.84,3.66 T_4.2 41.48,1.49 D_4.3
$1N12852: length 2.6
  Top Layer w0.254: 41.21,40.44 41.21,41.61 41.62,42.02 42.04,42.02 U15.C2
$1N22123: length 9.8
  Top Layer w1.524: D_5.3 D_5.1 67.9,7.45 T_5.2
$1N32305: length 10.4
  Top Layer w0.254: U16.9 48.55,33.45 X2.1 ; v3(45.93,38.44) 46.45,38.44 OCS2_C1.1
  Bottom Layer w0.254: X2.1 45.93,36.08 v3(45.93,38.44)
$1N32306: length 10.3
  Top Layer w0.254: 31.24,41.33 X3.1 ; 31.24,41.33 32.07,40.5 OCS1_C1.1 ; 31.24,41.33 U1.9
$1N32315: length 9.6
  Top Layer w0.254: X2.2 47.05,28.9 OCS2_C2.1
  Bottom Layer w0.254: X2.2 49.06,30.91 U16.10
$1N32316: length 9.7
  Top Layer w0.254: OCS1_C2.1 30.54,45.68 ; 30.54,45.68 28.73,43.87 U1.10 ; 30.54,45.68 X3.2
